# EAGLE design SecretAgentsSmashCompanion_Nano (EAGLE 9.3.0)
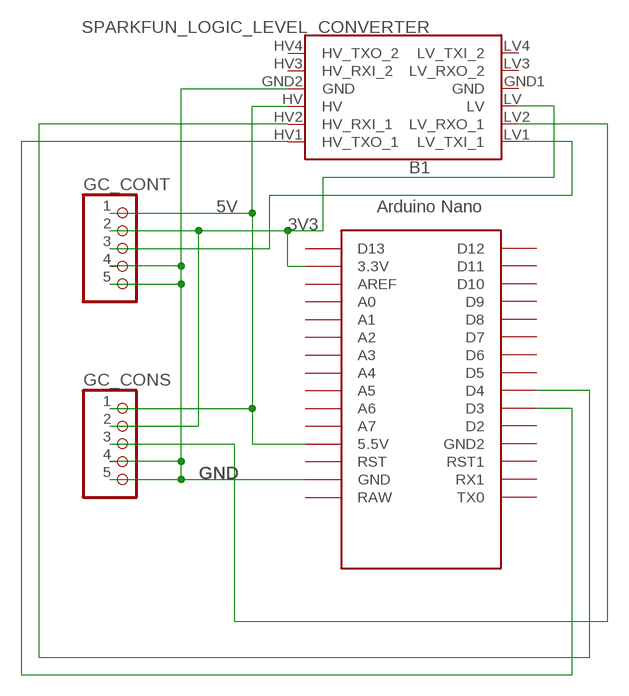
[diagram p0: schematic, sheet 1]

## Parts
B1  SPARKFUN_LOGIC_LEVEL_CONVERTER  [SPARKFUN_LOGIC_LEVEL_CONVERTER]
GC_CONS  PINHD-1X5  [1X05]
GC_CONT  PINHD-1X5  [1X05]
U$2  NANO  [NANO]

## Nets
3V3: B1.LV GC_CONS.2 GC_CONT.2 U$2.3.3V
5V: B1.HV GC_CONS.1 GC_CONT.1 U$2.5V(5.5V)
GND: B1.GND2(GND) GC_CONS.4 GC_CONS.5 GC_CONT.4 GC_CONT.5 U$2.GND
N$3: B1.LV2(LV_RXO_1) GC_CONS.3
N$4: B1.LV1(LV_TXI_1) GC_CONT.3
N$5: B1.HV2(HV_RXI_1) U$2.D4
N$6: B1.HV1(HV_TXO_1) U$2.D3
Unconnected: B1.HV3(HV_RXI_2) B1.HV4(HV_TXO_2) B1.LV3(LV_RXO_2) B1.LV4(LV_TXI_2) U$2.A0 U$2.A1 U$2.A2 U$2.A3 U$2.A4 U$2.A5 U$2.A6 U$2.A7 U$2.AREF U$2.D2 U$2.D5 U$2.D6 U$2.D7 U$2.D8 U$2.D9 U$2.D10 U$2.D11 U$2.D12 U$2.D13 U$2.GND1(GND2) U$2.ICSP1 U$2.ICSP2 U$2.ICSP3 U$2.ICSP4 U$2.ICSP5 U$2.ICSP6 U$2.RAW U$2.RST U$2.RST1 U$2.RX1 U$2.TX0

## Power pins joined to a net without a drawn wire
GND: B1.GND1(GND)

## Library data of the parts
B1 = SparkFun-Boards:SPARKFUN_LOGIC_LEVEL_CONVERTER: SparkFun Logic Level Converter -Bi-Directional This is the mechnical outline for the 3.3V - 5V bi directional logic level converter. *Note, the "LOCK" Package has the header pins staggered by an offset of 5 mils (off center line), so that when you slide a row of standard 0.1" headers into the PTH pads, it will hold position vertically. See the follwing turorial for more information on this type of special footprints: Sneaky Footprints <https://www.sparkfun.com/tutorials/114> SparkFun Products: SparkFun Logic Level Converter - Bi-Directional <https://www.sparkfun.com/products/12009>
GC_CONS GC_CONT = pinhead:PINHD-1X5: PIN HEADER
U$2 = Arduino_Nano:NANO: Arduino Nano

## Board
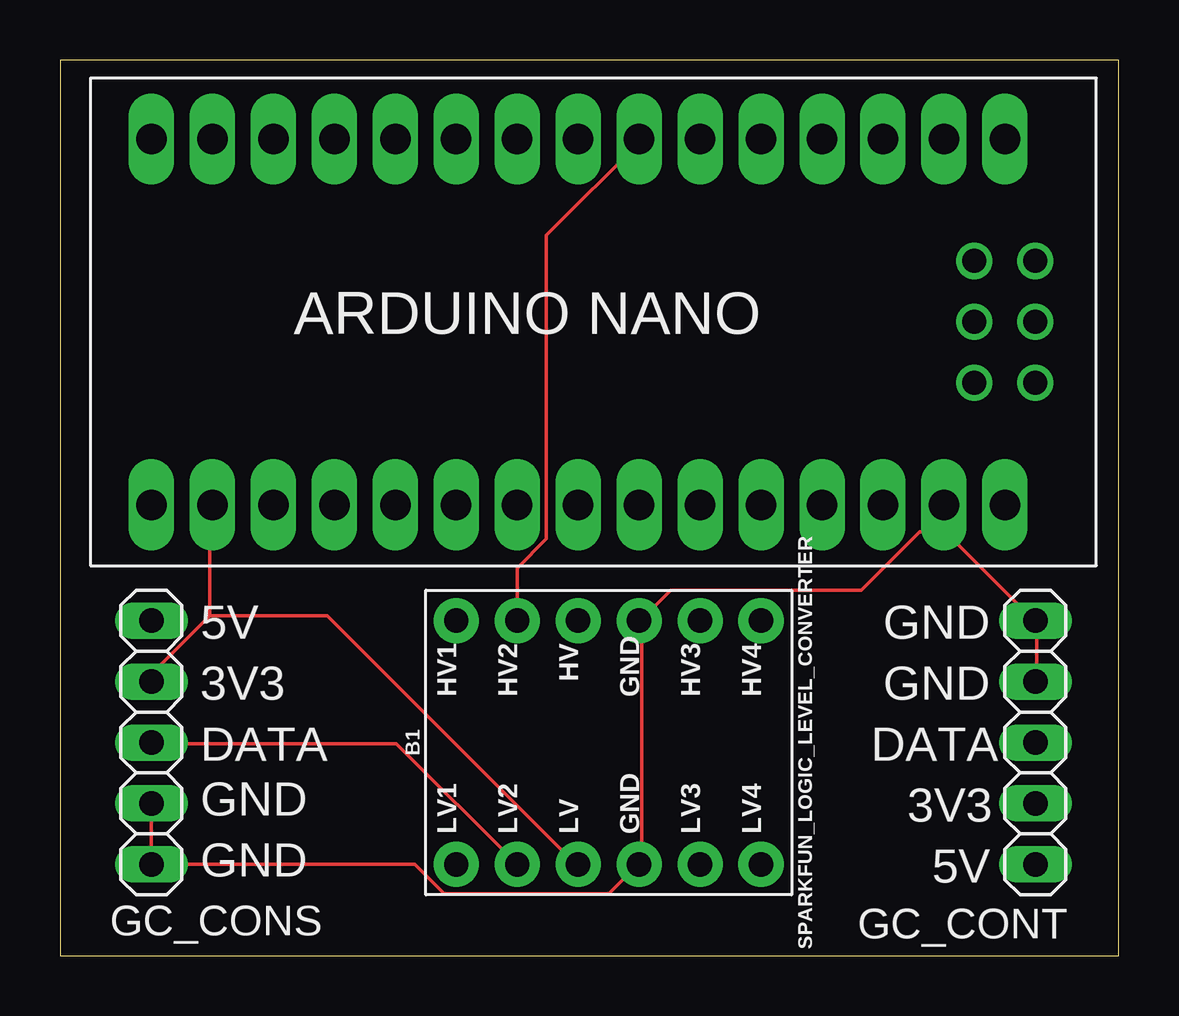
[diagram p1: board, top side]
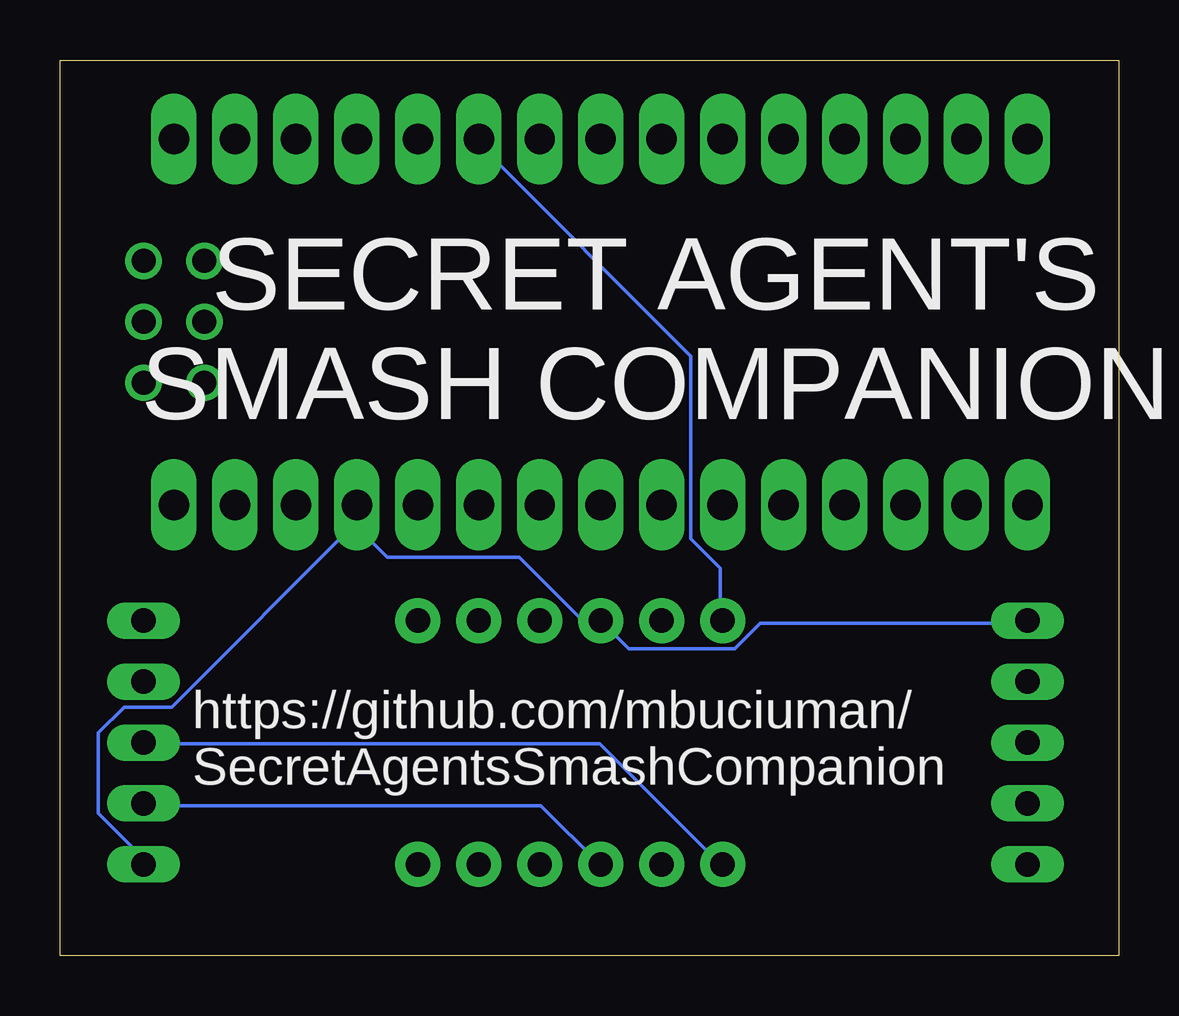
[diagram p2: board, bottom side, seen from below]

Size 44.12 x 37.33 mm. Coordinates in mm from the lower left corner, seen from the top.
Outline: 0,0 44.12,0 44.12,37.33 0,37.33 0,0
Copper layers (1*16): Top 0.035mm / dielectric 1.5mm / Bottom 0.035mm
Design rules "default": minimum track width 6mil, minimum drill 0.35mm, track to track 6mil, track to pad 6mil, pad to pad 6mil, via to via 6mil, smd to smd 6mil, copper to edge 40mil, drill to drill 6mil, minimum pad ring 10mil, minimum via ring 8mil, stop-mask expansion 4mil, vias tented up to drill 0mil, thermal gap 10mil

### Footprints (pad centres in the part's own frame; a part is rotated, then mirrored left to right if it is on the bottom)
SPARKFUN_LOGIC_LEVEL_CONVERTER = drill 1.016 pad 1.88: GND1 -5.08,-1.27; GND2 5.08,-1.27; HV 5.08,1.27; HV1 5.08,6.35; HV2 5.08,3.81; HV3 5.08,-3.81; HV4 5.08,-6.35; LV -5.08,1.27; LV1 -5.08,6.35; LV2 -5.08,3.81; LV3 -5.08,-3.81; LV4 -5.08,-6.35
1X05 = drill 1.016 long: 1 -5.08,0; 2 -2.54,0; 3 0,0; 4 2.54,0; 5 5.08,0
NANO = drill 1.27 long: 3.3V -10.16,24.13; 5V -10.16,-1.27; A0 -10.16,19.05; A1 -10.16,16.51; A2 -10.16,13.97; A3 -10.16,11.43; A4 -10.16,8.89; A5 -10.16,6.35; A6 -10.16,3.81; A7 -10.16,1.27; AREF -10.16,21.59; D2 5.08,1.27; D3 5.08,3.81; D4 5.08,6.35; D5 5.08,8.89; D6 5.08,11.43; D7 5.08,13.97; D8 5.08,16.51; D9 5.08,19.05; D10 5.08,21.59; D11 5.08,24.13; D12 5.08,26.67; D13 -10.16,26.67; GND -10.16,-6.35; GND1 5.08,-1.27; RAW -10.16,-8.89; RST -10.16,-3.81; RST1 5.08,-3.81; RX1 5.08,-6.35; TX0 5.08,-8.89 | drill 1: ICSP1 -5.08,-10.16; ICSP2 -5.08,-7.62; ICSP3 -2.54,-10.16; ICSP4 -2.54,-7.62; ICSP5 0,-10.16; ICSP6 0,-7.62

### Placement (x,y rotation side)
B1  22.86,8.89 90 top
GC_CONS  3.81,8.89 270 top
GC_CONT  40.64,8.89 90 top
U$2  30.48,28.96 90 top

### Tracks (layer width: path | path; a pad name or v marks a point on that pad's centre or on a via)
3V3
  Top 0.152: GC_CONS.2 3.81,11.73 6.25,14.17 | 6.25,14.17 6.25,18.75 U$2.3.3V | 6.25,14.17 11.12,14.17 21.49,3.81 B1.LV
  Bottom 0.152: GC_CONT.2 40.54,6.25 24.08,6.25 21.64,3.81 B1.LV
5V
  Bottom 0.152: GC_CONS.1 3.81,13.87 14.94,13.87 16,12.8 20.42,12.8 B1.HV 21.64,14.02 22.4,14.02 24.99,16.61 30.48,16.61 31.85,17.98 | 31.85,17.98 39.47,10.36 41.45,10.36 42.52,9.3 42.52,5.94 40.69,4.12 40.69,3.81 GC_CONT.1 | 31.85,17.98 31.85,18.75 U$2.5V 31.85,17.98
GND
  Top 0.152: GC_CONT.4 40.69,11.43 40.69,13.87 GC_CONT.5 40.54,14.02 36.88,17.68 | 36.88,17.68 36.88,18.75 U$2.GND 36.88,17.68 | GC_CONS.4 GC_CONS.5 14.78,3.81 16,2.59 22.86,2.59 24.08,3.81 B1.GND1 24.23,3.81 24.23,13.87 B1.GND2 24.23,14.02 25.45,15.24 33.38,15.24 35.81,17.68 36.88,17.68
N$3
  Top 0.152: B1.LV2 14.02,8.84 3.81,8.84 GC_CONS.3
N$4
  Bottom 0.152: GC_CONT.3 40.54,8.84 21.64,8.84 16.61,3.81 B1.LV1
N$5
  Top 0.152: B1.HV2 19.05,16.15 20.27,17.37 20.27,30.02 24.23,33.98 U$2.D4
N$6
  Bottom 0.152: U$2.D3 26.67,33.83 17.83,24.99 17.83,17.37 16.61,16.15 16.61,14.02 B1.HV1

### Text on the board
tPlace: 5V | GND | 3V3 | GND | DATA | DATA | GND | 3V3 | GND | 5V
bPlace: SECRET AGENT'S / SMASH COMPANION | https://github.com/mbuciuman/ / SecretAgentsSmashCompanion